# EasyEDA Pro project rc_tank.eprj

# Schematic project
Board Name: Board1; Create Date: 2025-09-07; Page Name: power1; Project Name: rc_tank; Schematic Name: project; Update Date: 2025-09-14; Company: 嘉立创EDA; Page Size: A4; Version: V1.0
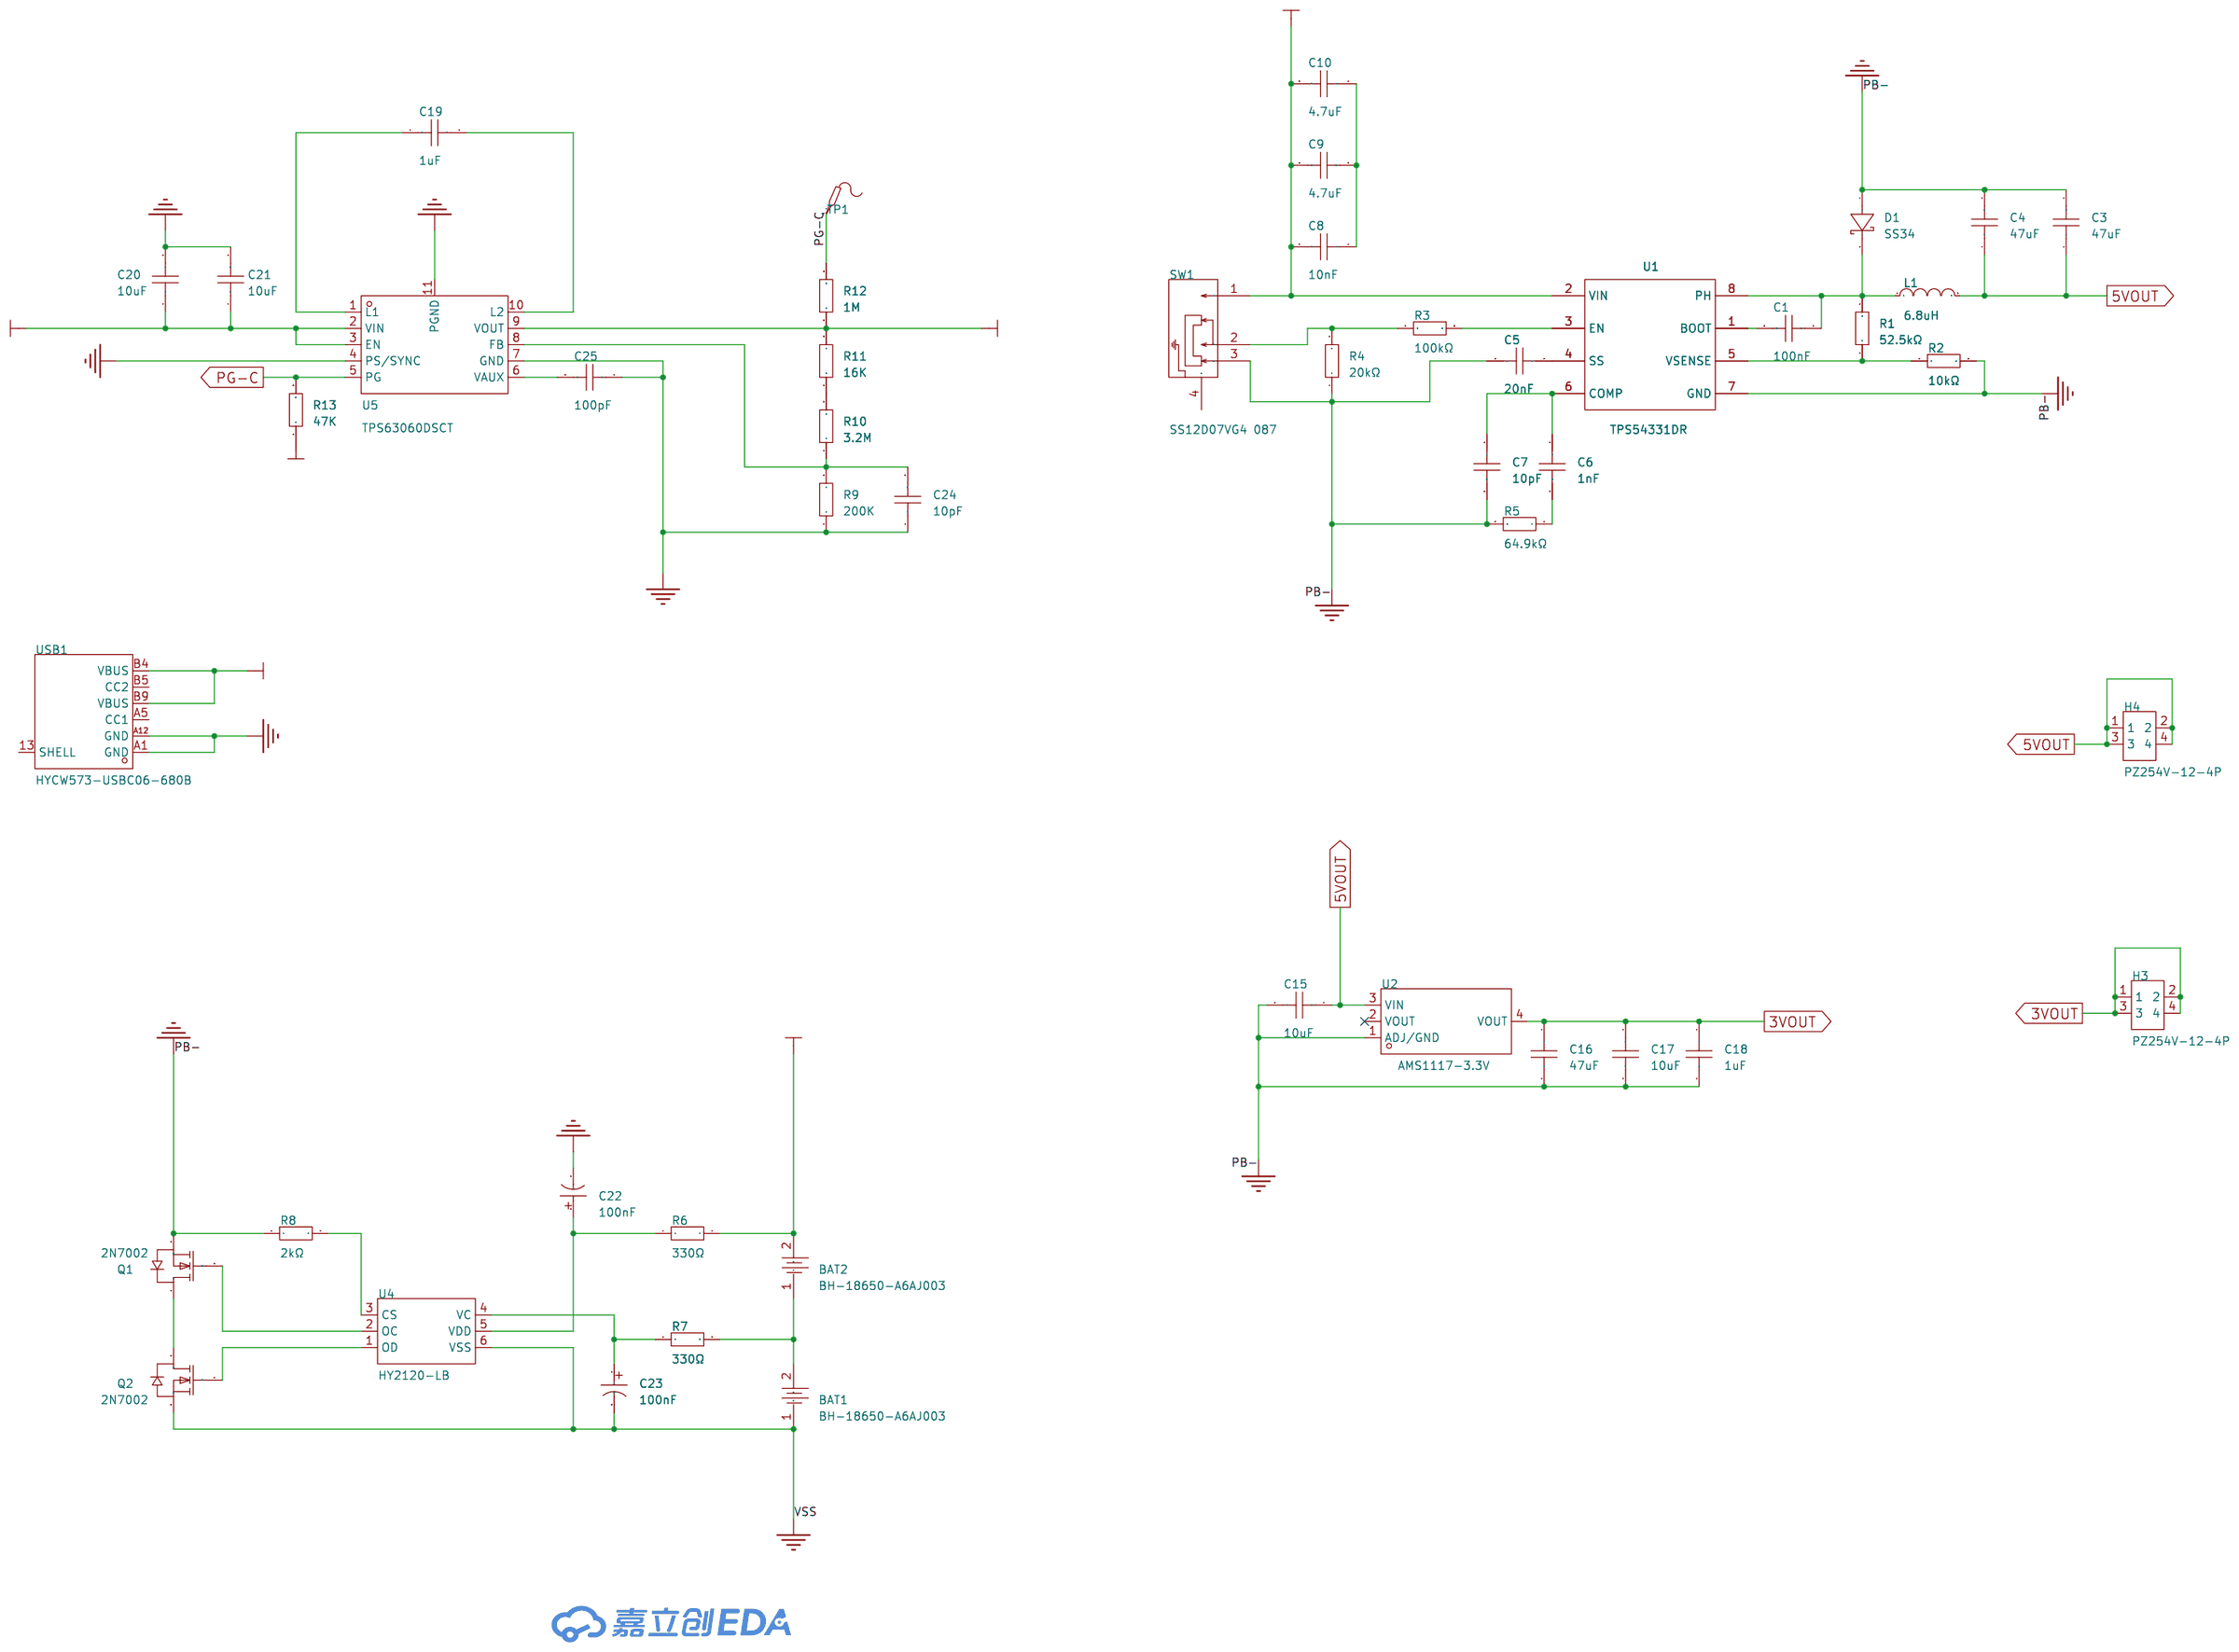
[diagram p0: schematic sheet]

## Parts
BAT1  BH-18650-A6AJ003  [BAT-TH_BH-18650-A5BJ003]
BAT2  BH-18650-A6AJ003  [BAT-TH_BH-18650-A5BJ003]
C1  100nF  [C0603]
C3  47uF  [CAP-TH_BD5.0-P2.00-D0.5-FD-A]
C4  47uF  [CAP-TH_BD5.0-P2.00-D0.5-FD-A]
C5  20nF  [C0603]
C6  1nF  [C0603]
C7  10pF  [C0603]
C8  10nF  [C0603]
C9  4.7uF  [C0805]
C10  4.7uF  [C0805]
C15  10uF  [CAP-TH_BD5.0-P2.00-D0.5-FD-A]
C16  47uF  [CAP-TH_BD6.3-P2.50-D0.6-FD]
C17  10uF  [CAP-TH_BD5.0-P2.00-D0.5-FD-A]
C18  1uF  [C0603]
C19  1uF  [C0603]
C20  10uF  [C0603]
C21  10uF  [C0603]
C22  100nF  [CAP-TH_BD5.0-P2.00-D0.8-FD]
C23  100nF  [CAP-TH_BD5.0-P2.00-D0.8-FD]
C24  10pF  [C0603]
C25  100pF  [C0603]
D1  SS34  [SMA_L4.3-W2.6-LS5.0-FD]
H3  PZ254V-12-4P  [HDR-TH_4P-P2.54-V-M-R2-C2-S2.54]
H4  PZ254V-12-4P  [HDR-TH_4P-P2.54-V-M-R2-C2-S2.54]
L1  6.8uH  [IND-SMD_L7.0-W6.6]
Q1  2N7002  [SOT-23-3_L2.9-W1.3-P1.90-LS2.4-BR]
Q2  2N7002  [SOT-23-3_L2.9-W1.3-P1.90-LS2.4-BR]
R1  52.5kΩ  [R0805]
R2  10kΩ  [R0603]
R3  100kΩ  [R0603]
R4  20kΩ  [R0603]
R5  64.9kΩ  [R0603]
R6  330Ω  [R0603]
R7  330Ω  [R0603]
R8  2kΩ  [R0603]
R9  200K  [R0603]
R10  3.2M  [R0603]
R11  16K  [R0603]
R12  1M  [R0603]
R13  47K  [R0603]
SW1  SS12D07VG4 087  [SW-TH_SS12D07VG4]
TP1  -  [Test-Point-0.5mm]
U1  TPS54331DR  [SOIC-8_L5.0-W4.0-P1.27-LS6.0-BL]
U2  AMS1117-3.3V  [SOT-223-4_L6.5-W3.5-P2.30-LS7.0-TR]
U4  HY2120-LB  [SOT-23-6_L2.9-W1.6-P0.95-LS2.8-BR]
U5  TPS63060DSCT  [WSON-10_L3.0-W3.0-P0.50-BL-EP-A]
USB1  HYCW573-USBC06-680B  [USB-C-SMD_HYCW573-USBC06-680B]

## Library data of the parts
BAT1 BAT2 = BH-18650-A6AJ003: Supplier Part: C5371778; Manufacturer: MYOUNG(美阳); JLCPCB Part Class: 扩展库; Datasheet: https://atta.szlcsc.com/upload/public/pdf/source/20231218/F59CE24993943D35EA131B0A1D7CE933.pdf; Supplier: LCSC; Contact Material: 不锈钢; Contact Plating: 镍; Operating Temperature Range: -25℃~+85℃
C1 = CGA0603X7R104K500JT: LCSC Part Name: 100nF ±10% 50V; Supplier Part: C6119867; Manufacturer: HRE(芯声); Supplier Footprint: 0603; JLCPCB Part Class: Extended Part; Datasheet: https://atta.szlcsc.com/upload/public/pdf/source/20250103/C44077DA9E7B3EFAE02F22B6D3D1CBC9.pdf; Supplier: LCSC; Tolerance: ±10%; Voltage Rating: 50V; Temperature Coefficient: X7R
C3 C4 = ERG35V47M5X11: LCSC Part Name: 47uF ±20% 35V; Supplier Part: C47344181; Manufacturer: JIERR(捷而瑞); Supplier Footprint: 插件,D5xL11mm; JLCPCB Part Class: Extended Part; Datasheet: https://item.szlcsc.com/datasheet/ERG35V47M5X11/49556622.html; Supplier: LCSC; Tolerance: ±20%; Voltage Rating: 35V; Ripple Current: 260mA@100kHz; Equivalent Series Resistance(ESR): 380mΩ@100kHz; Pin Spacing: 2mm; Diameter: 5mm; Height - Seated (Max): 11mm; Lifetime: 2000hrs@105℃; Operating Temperature: -40℃~+105℃
C5 = CC0603KRX7R9BB203: LCSC Part Name: 20nF ±10% 50V; Supplier Part: C282065; Manufacturer: YAGEO(国巨); Supplier Footprint: 0603; JLCPCB Part Class: Extended Part; Datasheet: https://atta.szlcsc.com/upload/public/pdf/source/20180910/C282072_33301C7F631E79921B82A8DAC6BCC5B3.pdf; Supplier: LCSC; Tolerance: ±10%; Voltage Rated: 50V; Temperature Coefficient: X7R
C6 = CC0603KRX7R9BB102: LCSC Part Name: 1nF ±10% 50V; Supplier Part: C100040; Manufacturer: YAGEO(国巨); Supplier Footprint: 0603; JLCPCB Part Class: Extended Part; Datasheet: https://atta.szlcsc.com/upload/public/pdf/source/20180910/C282072_33301C7F631E79921B82A8DAC6BCC5B3.pdf; Supplier: LCSC; Tolerance: ±10%; Voltage Rated: 50V; Temperature Coefficient: X7R
C7 = CL10C100JB8NNNC: LCSC Part Name: 10pF ±5% 50V; Supplier Part: C1634; Manufacturer: SAMSUNG(三星); Supplier Footprint: 0603; JLCPCB Part Class: Basic Part; Datasheet: https://item.szlcsc.com/datasheet/CL10C100JB8NNNC/1986.html; Supplier: LCSC; Tolerance: ±5%; Voltage Rating: 50V; Temperature Coefficient: C0G
C8 = 0603B103K500NT: LCSC Part Name: 10nF ±10% 50V; Supplier Part: C57112; Manufacturer: FH(风华); Supplier Footprint: 0603; JLCPCB Part Class: Basic Part; Datasheet: https://item.szlcsc.com/datasheet/0603B103K500NT/58143.html; Supplier: LCSC; Tolerance: ±10%; Voltage Rating: 50V; Temperature Coefficient: X7R
C9 C10 = CL21A475KAQNNNE: LCSC Part Name: 4.7uF ±10% 25V; Supplier Part: C1779; Manufacturer: SAMSUNG(三星); Supplier Footprint: 0805; JLCPCB Part Class: Basic Part; Datasheet: https://item.szlcsc.com/datasheet/CL21A475KAQNNNE/2131.html; Supplier: LCSC; Tolerance: ±10%; Voltage Rating: 25V; Temperature Coefficient: X5R
C15 C17 = ERG25V10M5X11: LCSC Part Name: 10uF ±20% 25V; Supplier Part: C47344176; Manufacturer: JIERR(捷而瑞); Supplier Footprint: 插件,D5xL11mm; JLCPCB Part Class: Extended Part; Datasheet: https://item.szlcsc.com/datasheet/ERG25V10M5X11/49556617.html; Supplier: LCSC; Tolerance: ±20%; Voltage Rating: 25V; Ripple Current: 100mA@100kHz; Equivalent Series Resistance(ESR): 3.3Ω@100kHz; Pin Spacing: 2mm; Diameter: 5mm; Height - Seated (Max): 11mm; Lifetime: 2000hrs@105℃; Operating Temperature: -40℃~+105℃
C16 = ERA50V47M6X11: LCSC Part Name: 47uF ±20% 50V; Supplier Part: C49256811; Manufacturer: JIERR(捷而瑞); Supplier Footprint: 插件,D6.3xL11mm; JLCPCB Part Class: Extended Part; Datasheet: https://item.szlcsc.com/datasheet/ERA50V47M6X11/51692211.html; Supplier: LCSC; Tolerance: ±20%; Voltage Rating: 50V; Ripple Current: 133mA@120Hz; Pin Spacing: 2.5mm; Diameter: 6.3mm; Height - Seated (Max): 11mm; Lifetime: 2000hrs@105℃; Operating Temperature: -40℃~+105℃
C18 = CL10A105KB8NNNC: LCSC Part Name: 1uF ±10% 50V; Supplier Part: C15849; Manufacturer: SAMSUNG(三星); Supplier Footprint: 0603; JLCPCB Part Class: Basic Part; Datasheet: https://item.szlcsc.com/datasheet/CL10A105KB8NNNC/16531.html; Supplier: LCSC; Tolerance: ±10%; Voltage Rating: 50V; Temperature Coefficient: X5R
C19-C21 C24 C25 = CAP_0603: Supplier Footprint: 0603
C22 C23 = KM104M050D11RR0VH2FP0: LCSC Part Name: 100nF ±20% 50V; Supplier Part: C28061; Manufacturer: Chengx(承兴); Supplier Footprint: 插件,D5xL11mm; JLCPCB Part Class: 扩展库; Datasheet: https://item.szlcsc.com/datasheet/KM104M050D11RR0VH2FP0/28811.html; Supplier: LCSC; Tolerance: ±20%; Voltage Rating: 50V; Pin Spacing: 2mm; Diameter: 5mm; Height - Seated (Max): 11mm; Lifetime: 1000hrs@105℃
D1 = SS34_C7420365: LCSC Part Name: 电压:40V 电流:3A; Supplier Part: C7420365; Manufacturer: R+O(宏嘉诚); Supplier Footprint: SMA(DO-214AC); JLCPCB Part Class: 扩展库; Datasheet: https://item.szlcsc.com/datasheet/SS34/8397187.html; Supplier: LCSC; Diode Configuration: 独立式; Voltage - Forward(Vf@If): 550mV@3.0A; Voltage - DC Reverse(Vr): 40V; Current - Rectified: 3A; Reverse Leakage Current (Ir): 200uA@40V
H3 H4 = PZ254V-12-4P: LCSC Part Name: 2x2P 间距:2.54mm 方针 直插; Supplier Part: C492419; Manufacturer: XFCN(兴飞); Supplier Footprint: 插件,P=2.54mm; JLCPCB Part Class: 扩展库; Datasheet: https://item.szlcsc.com/datasheet/PZ254V-12-4P/502975.html; Supplier: LCSC; Pin Structure: 2x2P; Pitch: 2.54mm; Row Spacing: 2.54mm; Circluar Pins/Square Pins: 方针; Mounting Type: 直插; Number of Rows: 双排; Number of Pins: 4P; Length of Mating Pin: 6mm; Insulation Height: 2.5mm; Length of End Connection Pin: 3mm; Contact Material: 黄铜; Operating Temperature: -40℃~+105℃; Color: 黑色
L1 = FXL0630-6R8-M: LCSC Part Name: 6.8uH ±20% 6A; Supplier Part: C167221; Manufacturer: cjiang(长江微电); Supplier Footprint: SMD,6.6x7mm; JLCPCB Part Class: Extended Part; Datasheet: https://atta.szlcsc.com/upload/public/pdf/source/20250421/DC75C633ACB13F952A25DE8912719752.pdf; Supplier: LCSC; Tolerance: ±20%; Current Rating: 5A; Current - Saturation(Isat): 6A; DC Resistance(DCR): 48mΩ; Type: 一体成型电感
Q1 Q2 = 2N7002_C7420321: LCSC Part Name: N沟道,电流:115mA,耐压:60V; Supplier Part: C7420321; Manufacturer: R+O(宏嘉诚); Supplier Footprint: SOT-23; JLCPCB Part Class: 扩展库; Datasheet: https://item.szlcsc.com/datasheet/2N7002/8397143.html; Supplier: LCSC; Number: 1个N沟道; Drain to Source Voltage: 60V; Current - Continuous Drain(Id): 115mA; RDS(on): 900mΩ@10V; Pd - Power Dissipation: 225mW; Gate Threshold Voltage (Vgs(th)): 1.6V@250uA; Gate Charge(Qg): 1.6nC@10V; Input Capacitance(Ciss): 50pF; Reverse Transfer Capacitance (Crss@Vds): 5pF; Operating Temperature: -55℃~+150℃; Type: N沟道; Output Capacitance(Coss): 25pF
R1 = PHT0805Y5252BGT: LCSC Part Name: 52.5kΩ ±0.1%; Supplier Part: C4184401; Manufacturer: VISHAY(威世); JLCPCB Part Class: Extended Part; Datasheet: https://atta.szlcsc.com/upload/public/pdf/source/20241111/797EBD90FB0B2A6A48D0A1D987241273.pdf; Supplier: LCSC; Tolerance: ±0.1%
R2 = 0603WAF1002T5E: LCSC Part Name: 厚膜电阻 10kΩ ±1% 100mW; Supplier Part: C25804; Manufacturer: UNI-ROYAL(厚声); Supplier Footprint: 0603; JLCPCB Part Class: Basic Part; Datasheet: https://item.szlcsc.com/datasheet/0603WAF1002T5E/26547.html; Supplier: LCSC; Type: 厚膜电阻; Tolerance: ±1%; Power(Watts): 100mW; Voltage-Supply(Max): 75V; Temperature Coefficient: ±100ppm/℃; Operating Temperature: -55℃~+155℃
R3 = 0603WAF1003T5E: LCSC Part Name: 100kΩ ±1% 100mW 厚膜电阻; Supplier Part: C25803; Manufacturer: UNI-ROYAL(厚声); Supplier Footprint: 0603; JLCPCB Part Class: Basic Part; Datasheet: https://item.szlcsc.com/datasheet/0603WAF1003T5E/26546.html; Supplier: LCSC; Type: 厚膜电阻; Tolerance: ±1%; Power(Watts): 100mW; Voltage-Supply(Max): 75V; Temperature Coefficient: ±100ppm/℃; Operating Temperature: -55℃~+155℃
R4 = 0603WAF2002T5E: LCSC Part Name: 20kΩ ±1% 100mW 厚膜电阻; Supplier Part: C4184; Manufacturer: UNI-ROYAL(厚声); Supplier Footprint: 0603; JLCPCB Part Class: Basic Part; Datasheet: https://item.szlcsc.com/datasheet/0603WAF2002T5E/4591.html; Supplier: LCSC; Type: 厚膜电阻; Tolerance: ±1%; Power(Watts): 100mW; Voltage-Supply(Max): 75V; Temperature Coefficient: ±100ppm/℃; Operating Temperature: -55℃~+155℃
R5 = FRC0603F6492TS: LCSC Part Name: 64.9kΩ ±1% 100mW 厚膜电阻; Supplier Part: C2960807; Manufacturer: FOJAN(富捷); Supplier Footprint: 0603; JLCPCB Part Class: Extended Part; Datasheet: https://item.szlcsc.com/datasheet/FRC0603F6492TS/3347909.html; Supplier: LCSC; Type: 厚膜电阻; Tolerance: ±1%; Power(Watts): 100mW; Voltage-Supply(Max): 75V; Temperature Coefficient: ±100ppm/℃; Operating Temperature: -55℃~+155℃
R6-R13 = Res_0603: Supplier Footprint: 0603
SW1 = SS12D07VG4 087: Supplier Part: C2939726; Manufacturer: SHOU HAN(首韩); Supplier Footprint: 插件; JLCPCB Part Class: Extended Part; Datasheet: https://atta.szlcsc.com/upload/public/pdf/source/20220106/E715996F66241B9FD900079FF66489BE.pdf; Supplier: LCSC; Circuit: 单刀双掷; Pin Style: PC引脚; Switch Length: 8.7mm; Switch Width: 4.4mm; Switch Height: 4.7mm; Mounting Style: 直插; Current Rating (DC): 500mA; Voltage Rating (DC): 50V; Mechanical Life: 5千次; Operating Temperature: -10℃~+50℃
TP1 = Test-Point
U1 = TPS54331DR: LCSC Part Name: 3A, 28V 输入非同步降压转换器; Supplier Part: C9865; Manufacturer: TI(德州仪器); Supplier Footprint: SOIC-8; JLCPCB Part Class: 扩展库; Datasheet: https://www.ti.com/cn/lit/gpn/tps54331; Supplier: LCSC; Function: 降压型; Output Type: 可调; Input Voltage: 3.5V~28V; Output Current: 3A; Switching Frequency: 570kHz; Operating Temperature: -40℃~+150℃@(TJ); Synchronous Rectification: 否; Number of Outputs: 1; Topology: 降压式; Quiescent Current (Iq): 1mA; Switch tube (built-in/external): 内置
U2 = AMS1117-3.3V: LCSC Part Name: 输入18V 输出3.3V 1A; Supplier Part: C5120765; Manufacturer: MSKSEMI(美森科); Supplier Footprint: SOT-223; JLCPCB Part Class: 扩展库; Datasheet: https://item.szlcsc.com/datasheet/AMS1117-3.3V/5706124.html; Supplier: LCSC; Output Type: 固定; Voltage - Supply: 12V; Output Voltage: 3.3V; Output Current: 1A; Voltage Dropout: 1.4V@(1A); standby current: 12mA; Features: 过流保护；过热保护; Operating Temperature: 0℃~+125℃@(Ta); Output Configuration: 正极; Number of Outputs: 1
U4 = HY2120-LB: Supplier Part: C168778; Manufacturer: HYCON(宏康); Supplier Footprint: SOT-23-6; JLCPCB Part Class: 扩展库; Datasheet: https://item.szlcsc.com/datasheet/HY2120-LB/180162.html; Supplier: LCSC; The Chip Type: 保护芯片; Voltage - Supply: 1.5V~10V; Charging Saturation Voltage: 4.25V; End-Off Voltage: 2.8V; Type of Battery: 锂离子/聚合物; Number of Cells: 2; Operating Temperature: -40℃~+85℃; 0V Battery Charge: 支持; Supply Current (Iq): 100nA
U5 = TPS63060DSCT: LCSC Part Name: 2A高输入电压降压-升压转换器; Supplier Part: C2070911; Manufacturer: TI(德州仪器); Supplier Footprint: WSON-10-EP(3x3); JLCPCB Part Class: 扩展库; Datasheet: https://www.ti.com/cn/lit/gpn/tps63060; Supplier: LCSC; Function: 升降压型; Output Type: 可调和固定; Input Voltage: 2.5V~12V; Output Current: 2A; Switching Frequency: 2.4MHz; Operating Temperature: -40℃~+85℃@(TA); Synchronous Rectification: 是; Number of Outputs: 1; Topology: 降压-升压式; Quiescent Current (Iq): 30uA; Switch tube (built-in/external): 内置
USB1 = HYCW573-USBC06-680B: LCSC Part Name: Type-C 母 立贴; Supplier Part: C42400237; Manufacturer: 华宇创; Supplier Footprint: SMD; Datasheet: https://item.szlcsc.com/datasheet/HYCW573-USBC06-680B/44352770.html; Supplier: LCSC; Connector Type: Type-C; Gender: 母; Mounting Type: 立贴; Number of Contacts: 6P; Number of Ports: 1; Current Rating-Power: 3A; Connect-Disconnect Life: 5千次; Length: 6.8mm; Detection color: 黑色; Operating Temperature: -25℃~+85℃

## Nets
3VOUT: C16.1 C17.1 C18.1 H3.1 H3.2 H3.3 H3.4 U2.4(VOUT)
5VOUT: C3.1 C4.1 C15.1 H4.1 H4.2 H4.3 H4.4 L1.2 U2.3(VIN)
VCC-OUT: BAT2.2 C8.2 C9.2 C10.2 R6.2 R11.2 R12.1 SW1.1 U1.2(VIN) U5.9(VOUT)
VIN: C20.1 C21.1 R13.1 U5.2(VIN) U5.3(EN) USB1.B4(VBUS) USB1.B9(VBUS)
VSS: BAT1.1 C20.2 C21.2 C22.2 C23.2 C24.1 C25.1 Q2.2(S) R9.1 U4.6(VSS) U5.4(PS/SYNC) U5.7(GND) U5.11(PGND) USB1.A1(GND) USB1.A12(GND)
PB-: C3.2 C4.2 C5.2 C7.2 C15.2 C16.2 C17.2 C18.2 D1.1(A) Q1.2(S) R2.2 R4.1 R5.2 R8.1 SW1.3 U1.7(GND) U2.1(ADJ/GND)
PG-C: R12.2 R13.2 TP1.1 U5.5(PG)
$1N828: C1.2 U1.1(BOOT)
$1N1404: R1.1 R2.1 U1.5(VSENSE)
$1N1436: R3.2 U1.3(EN)
$1N1441: R3.1 R4.2 SW1.2
$1N1501: C5.1 U1.4(SS)
$1N1628: C6.2 R5.1
$1N1677: C6.1 C7.1 U1.6(COMP)
$1N1713: C1.1 D1.2(K) L1.1 R1.2 U1.8(PH)
$1N7780: C8.1 C9.1 C10.1
$1N9160: C19.2 U5.10(L2)
$1N9166: C19.1 U5.1(L1)
$1N9574: C22.1 R6.1 U4.5(VDD)
$1N9627: C23.1 R7.1 U4.4(VC)
$1N9632: BAT1.2 BAT2.1 R7.2
$1N10063: Q1.3(D) Q2.3(D)
$1N10067: Q1.1(G) U4.2(OC)
$1N10072: Q2.1(G) U4.1(OD)
$1N10126: R8.2 U4.3(CS)
$1N10297: R10.2 R11.1
$1N10312: C24.2 R9.2 R10.1 U5.8(FB)
$1N10659: C25.2 U5.6(VAUX)

Not connected (* = marked no-connect by the designer): SW1 4; U2 2(VOUT)*; USB1 13(SHELL) A5(CC1) B5(CC2)

# Board PCB1
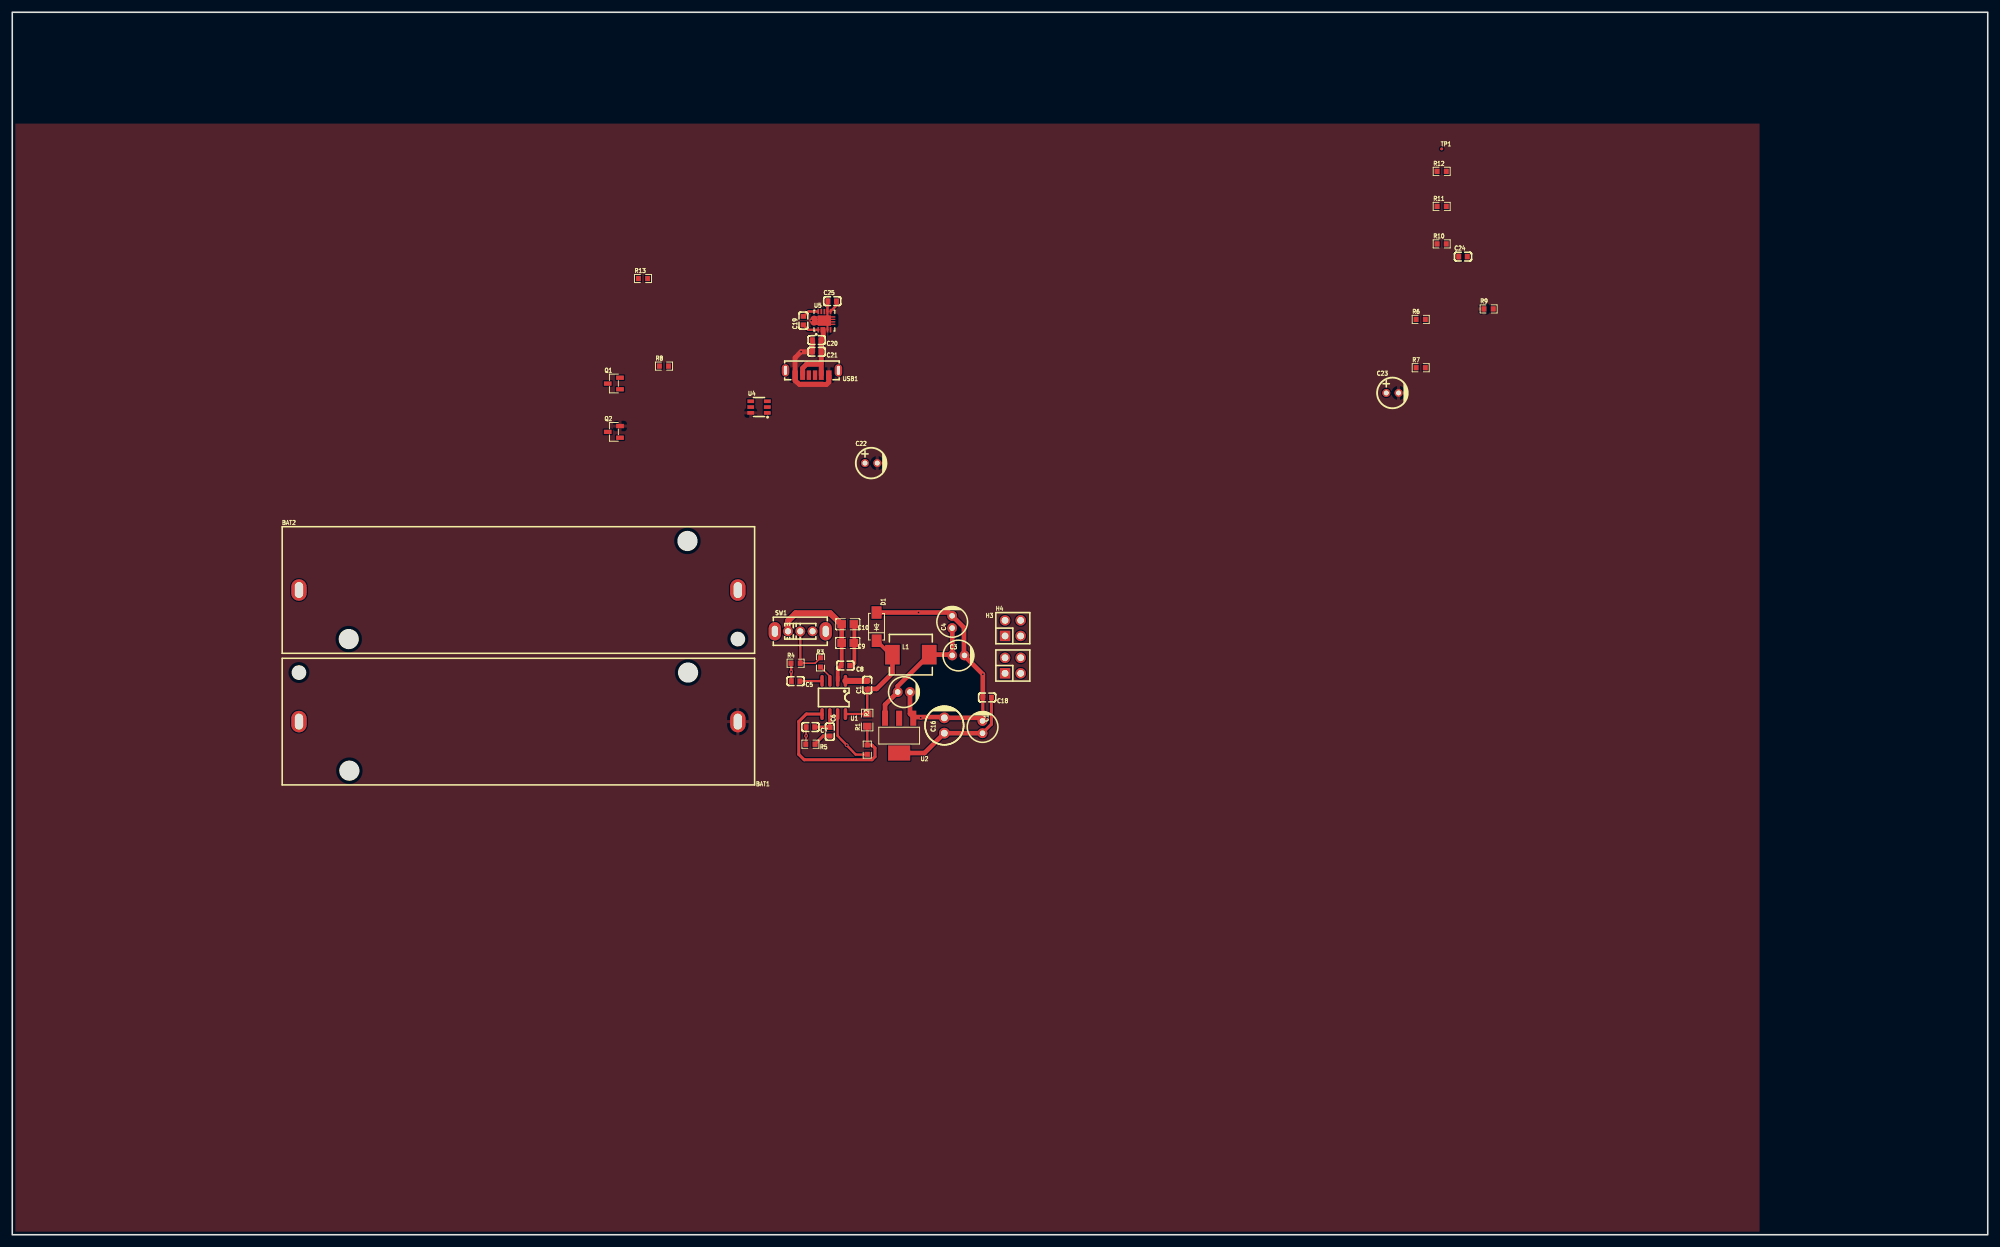
[diagram p1: board, top side]
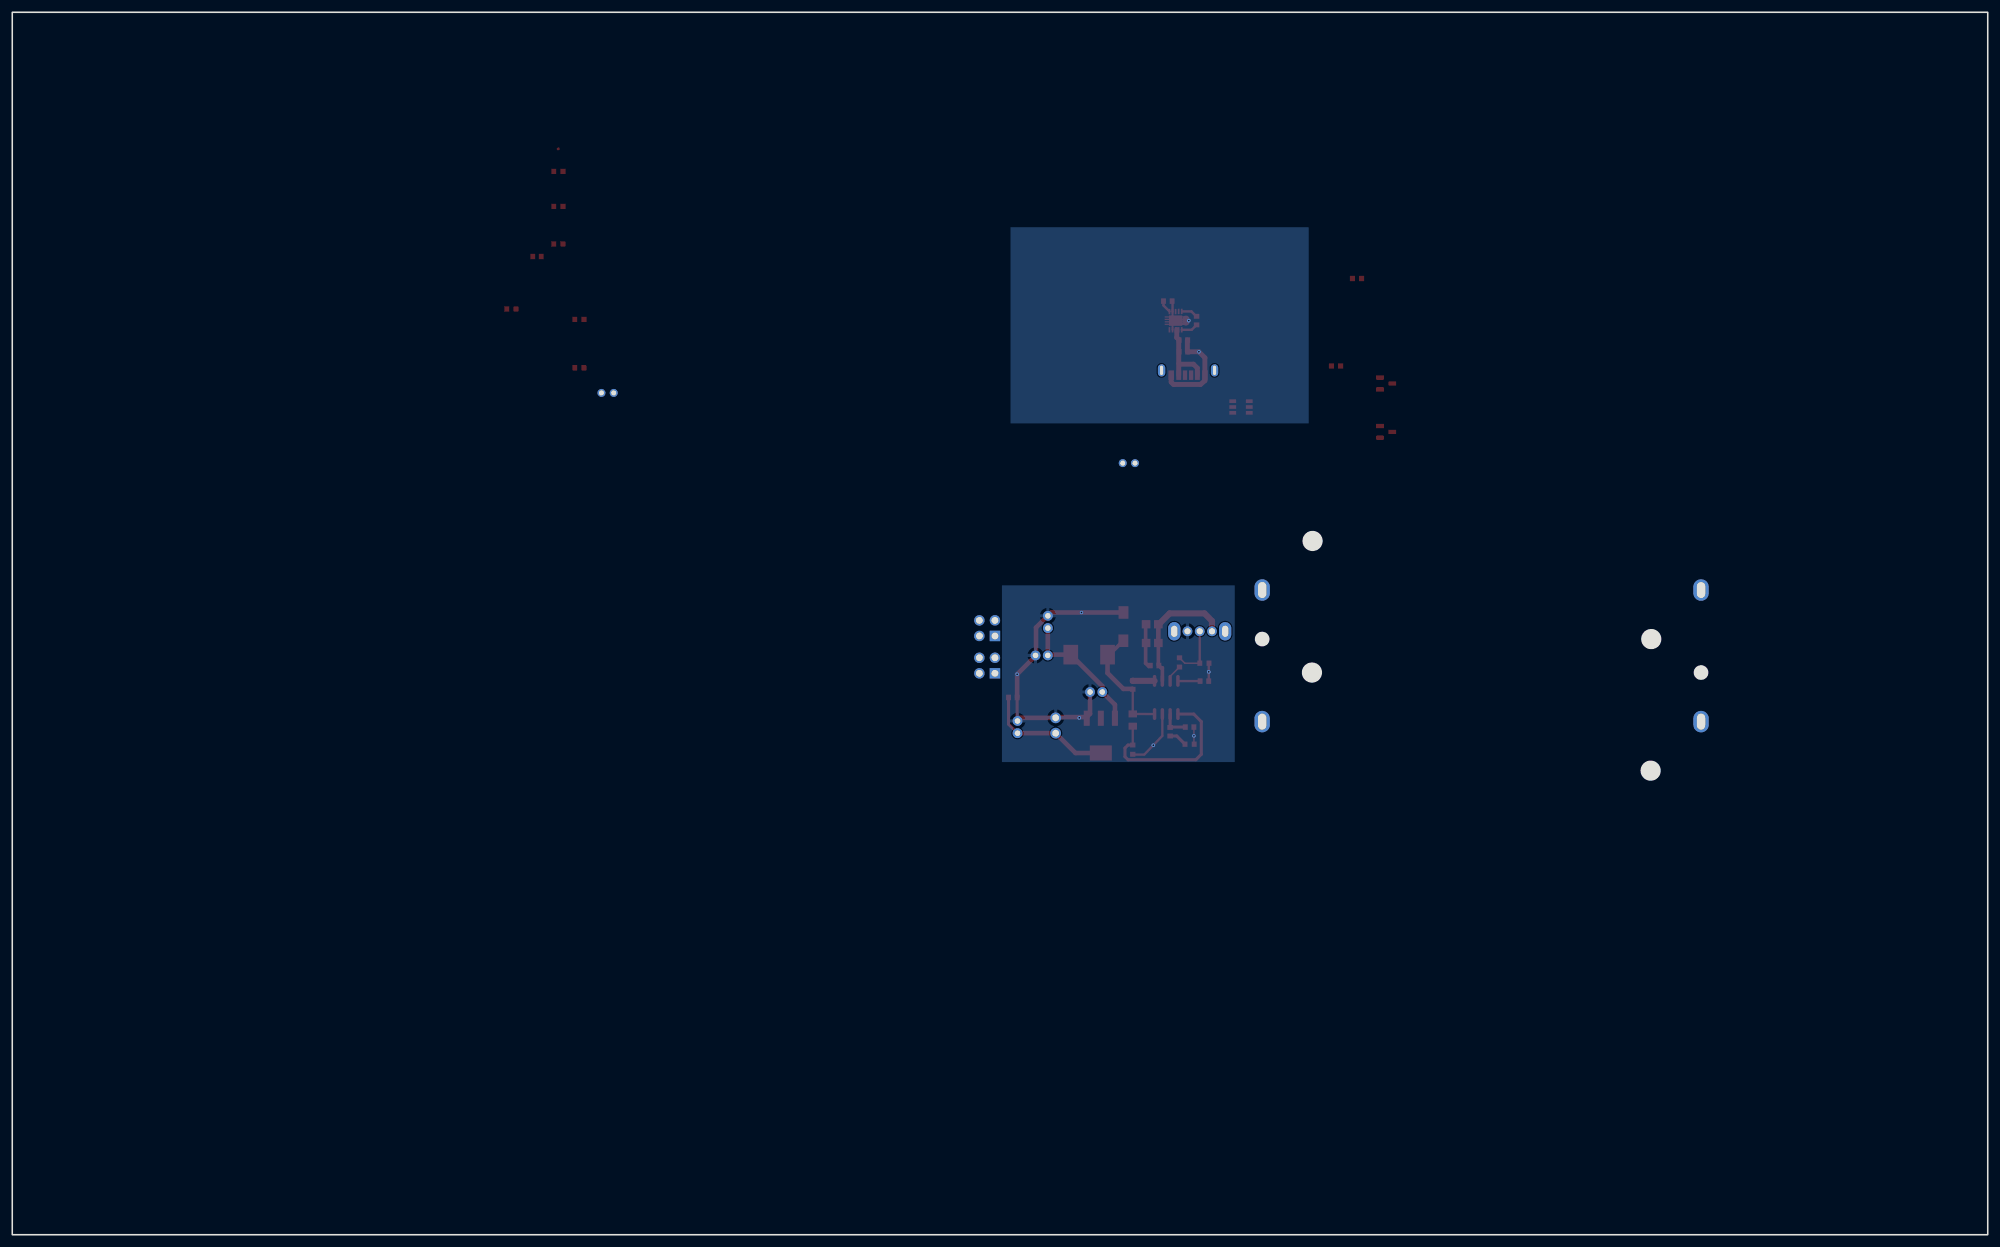
[diagram p2: board, bottom side, seen from below]

Outline 322.2 x 199.39 mm; copper layers: Top Layer, Bottom Layer. Coordinates in mm from the lower left corner of the outline.
Outline path: rectangle 322.2,0 0,199.39
Stack: Top Layer 0.035mm / Dielectric1 1.51mm FR4 er 4.5 / Bottom Layer 0.035mm

## Design rules (mm)
template: JLCPCB Capability(Two Layers Board)
spacing copperThickness1oz (default): track to track 0.102, other pairs 0.152 to 0.3
spacing copperThickness2oz: track to track 0.203, other pairs 0.152 to 0.3
track width copperThickness1oz (default): min 0.127, default 0.254, max 2.54
track width copperThickness2oz: min 0.203, default 0.254, max 2.54
differential pair differentialPair (default): width min 0.127, default 0.254, max 2.54; gap min 0.152, default 0.152
via viaSize (default): diameter min 0.5, default 0.61, max 10; hole min 0.3, default 0.305, max 6.3

## Placement (name value [footprint] x y rotation side)
BAT1  BH-18650-A6AJ003  [BAT-TH_BH-18650-A5BJ003]  82.55 83.69 180 top
BAT2  BH-18650-A6AJ003  [BAT-TH_BH-18650-A5BJ003]  82.55 105.16 0 top
C1  100nF  [C0603]  139.45 89.66 90 top
C3  47uF  [CAP-TH_BD5.0-P2.00-D0.5-FD-A]  154.31 94.49 0 top
C4  47uF  [CAP-TH_BD5.0-P2.00-D0.5-FD-A]  153.29 99.95 90 top
C5  20nF  [C0603]  127.76 90.3 180 top
C6  1nF  [C0603]  133.35 82.04 270 top
C7  10pF  [C0603]  130.18 82.8 180 top
C8  10nF  [C0603]  135.89 92.84 180 top
C9  4.7uF  [C0805]  136.27 96.52 180 top
C10  4.7uF  [C0805]  136.27 99.57 180 top
C15  10uF  [CAP-TH_BD5.0-P2.00-D0.5-FD-A]  145.42 88.52 0 top
C16  47uF  [CAP-TH_BD6.3-P2.50-D0.6-FD]  152.02 83.06 90 top
C17  10uF  [CAP-TH_BD5.0-P2.00-D0.5-FD-A]  158.24 82.8 90 top
C18  1uF  [C0603]  159 87.63 180 top
C19  1uF  [C0603]  129.03 149.1 90 top
C20  10uF  [C0603]  131.19 145.92 180 top
C21  10uF  [C0603]  131.19 144.02 180 top
C22  100nF  [CAP-TH_BD5.0-P2.00-D0.8-FD]  140.08 125.86 0 top
C23  100nF  [CAP-TH_BD5.0-P2.00-D0.8-FD]  225.1 137.3 0 top
C24  10pF  [C0603]  236.62 159.54 0 top
C25  100pF  [C0603]  133.73 152.27 0 top
D1  SS34  [SMA_L4.3-W2.6-LS5.0-FD]  140.97 99.19 270 top
H3  PZ254V-12-4P  [HDR-TH_4P-P2.54-V-M-R2-C2-S2.54]  163.19 92.84 0 top
H4  PZ254V-12-4P  [HDR-TH_4P-P2.54-V-M-R2-C2-S2.54]  163.19 98.93 0 top
L1  6.8uH  [IND-SMD_L7.0-W6.6]  146.56 94.62 0 top
Q1  2N7002  [SOT-23-3_L2.9-W1.3-P1.90-LS2.4-BR]  98.12 138.84 0 top
Q2  2N7002  [SOT-23-3_L2.9-W1.3-P1.90-LS2.4-BR]  98.12 130.95 0 top
R1  52.5kΩ  [R0805]  139.45 83.95 90 top
R2  10kΩ  [R0603]  139.45 79.12 270 top
R3  100kΩ  [R0603]  131.83 93.35 270 top
R4  20kΩ  [R0603]  127.76 93.22 0 top
R5  64.9kΩ  [R0603]  130.18 80.01 180 top
R6  330Ω  [R0603]  229.71 149.3 0 top
R7  330Ω  [R0603]  229.71 141.41 0 top
R8  2kΩ  [R0603]  106.29 141.68 0 top
R9  200K  [R0603]  240.79 151 0 top
R10  3.2M  [R0603]  233.14 161.61 0 top
R11  16K  [R0603]  233.14 167.73 0 top
R12  1M  [R0603]  233.14 173.45 0 top
R13  47K  [R0603]  102.87 155.96 0 top
SW1  SS12D07VG4 087  [SW-TH_SS12D07VG4]  128.52 98.43 0 top
TP1  -  [Test-Point-0.5mm]  233.14 177.11 0 top
U1  TPS54331DR  [SOIC-8_L5.0-W4.0-P1.27-LS6.0-BL]  133.99 87.63 180 top
U2  AMS1117-3.3V  [SOT-223-4_L6.5-W3.5-P2.30-LS7.0-TR]  144.65 81.41 180 top
U4  HY2120-LB  [SOT-23-6_L2.9-W1.6-P0.95-LS2.8-BR]  121.79 135 0 top
U5  TPS63060DSCT  [WSON-10_L3.0-W3.0-P0.50-BL-EP-A]  132.46 149.1 0 top
USB1  HYCW573-USBC06-680B  [USB-C-SMD_HYCW573-USBC06-680B]  130.43 140.59 180 top

## Footprints (pads in the part's own frame, mm; a bottom-side part is the same pattern mirrored in y, then rotated)
BAT-TH_BH-18650-A5BJ003
  oval 2.5x3.5 hole 1.34x2.58: 1(-35.79,0) 2(35.79,0)
C0603
  rect 0.8x0.9 smd: 1(-0.7,0) 2(0.7,0)
C0805
  rect 1.41x1.35 smd: 1(-1,0) 2(1,0)
CAP-TH_BD5.0-P2.00-D0.5-FD-A
  round 1.6 hole 0.9: 1(-1,0) 2(1,0)
CAP-TH_BD5.0-P2.00-D0.8-FD
  round 1.3 hole 0.8: 1(-1,0) 2(1,0)
CAP-TH_BD6.3-P2.50-D0.6-FD
  round 1.75 hole 1.1: 1(-1.25,0) 2(1.25,0)
HDR-TH_4P-P2.54-V-M-R2-C2-S2.54
  rect 1.7x1.7 hole 1.1: 1(-1.27,-1.27)
  round 1.7 hole 1.1: 2(-1.27,1.27) 3(1.27,-1.27) 4(1.27,1.27)
IND-SMD_L7.0-W6.6
  rect 2.4x3.2 smd: 1(-3,0) 2(3,0)
R0603
  rect 0.806x0.864 smd: 1(-0.753,0) 2(0.753,0)
R0805
  rect 1.133x1.377 smd: 1(-1,0) 2(1,0)
SMA_L4.3-W2.6-LS5.0-FD
  rect 2.046x1.62 smd: 1(-2.304,-0.009) 2(2.304,0.009)
SOIC-8_L5.0-W4.0-P1.27-LS6.0-BL
  oval 0.569x1.95 smd: 1(-1.905,-2.705) 2(-0.635,-2.705) 3(0.635,-2.705) 4(1.905,-2.705) 5(1.905,2.705) 6(0.635,2.705) 7(-0.635,2.705) 8(-1.905,2.705)
SOT-23-3_L2.9-W1.3-P1.90-LS2.4-BR
  rect 1.25x0.7 smd: 1(1,-0.95) 2(1,0.95) 3(-1,0)
SOT-23-6_L2.9-W1.6-P0.95-LS2.8-BR
  rect 1.1x0.6 smd: 1(1.35,-0.95) 2(1.35,0) 3(1.35,0.95) 4(-1.35,0.95) 5(-1.35,0) 6(-1.35,-0.95)
SOT-223-4_L6.5-W3.5-P2.30-LS7.0-TR
  rect 0.98x2.47 smd: 1(-2.3,-2.835) 2(0,-2.835) 3(2.3,-2.835)
  rect 3.6x2.47 smd: 4(0,2.835)
SW-TH_SS12D07VG4
  oval 1.6x1.6 hole 1: 1(-2,0) 2(0,0) 3(2,0)
  oval 2x3 hole 1x1.8: 4(4.15,0) 5(-4.15,0)
Test-Point-0.5mm
  round 0.5 smd: 1(0,0)
USB-C-SMD_HYCW573-USBC06-680B
  oval 1.2x2 hole 0.5x1.5: 13(-4.32,-0.388) 13(4.32,-0.388)
  rect 0.9x1.55 smd: A1(2.75,0.388) A12(-2.75,0.388)
  rect 0.7x1.55 smd: A5(0.5,0.388) B5(-0.5,0.388)
  rect 0.8x1.55 smd: B4(-1.52,0.388) B9(1.52,0.388)
WSON-10_L3.0-W3.0-P0.50-BL-EP-A
  rect 0.28x0.876 smd: 1(-1,-1.5) 2(-0.5,-1.5) 3(0,-1.5) 4(0.5,-1.5) 5(1,-1.5) 6(1,1.474) 7(0.499,1.472) 8(-0.001,1.473) 9(-0.5,1.5) 10(-1,1.5)
  custom 3.55x1.7 smd: 11(0,0)

## Nets
As in the schematic.

Pads without a net: SW1 4 5; U2 2; USB1 13 A5 B5

## Via types
v1: diameter 0.61, hole 0.305, Top Layer to Bottom Layer, 8 vias

## Routing (per net, layer and track width the routed paths; a pad name or vN(x,y) marks a point on that pad's centre or on a via; arc(x,y) is an arc through that point)
VSS: length 21.9
  Top Layer w0.3: U5.7 132.96,149.87 132.97,149.86 ; 130.83,148.54 132.96,148.54 132.96,147.6 132.97,147.6
  Top Layer w0.4: C25.1 132.96,152.2 132.96,150.57
  Top Layer w0.8: 130.54,145.92 130.54,144.07 C21.2 v1(128.65,144.02) 127.68,143.03 127.68,139.3 128.4,138.68 132.8,138.68 133.18,139.07 USB1.A12
  Top Layer w1.2: 130.77,148.88 130.77,149.31
  vias: v1(130.3,149.1)
PB-: length 62.9
  Top Layer w0.254: C7.2 v1(129.47,81.36) 129.47,80.06 R5.2
  Top Layer w0.381: 127.05,93.21 127.05,90.41 126.94,90.3 ; U1.7 134.62,81.37 137.56,78.32 139.45,78.32
  Top Layer w0.5: 158.3,87.63 158.3,83.87 C17.2
  Top Layer w0.75: D1.1 152.76,101.49 155.22,99.03 155.22,94.5 v1(158.3,91.42) 158.3,87.63 ; 146.42,88.41 146.42,84.97 146.95,84.43 152.04,84.43 152.15,84.33 ; C16.2 158.24,84.31
  vias: v1(127.05,91.81) v1(136.09,79.85) v1(147.81,101.49) v1(148.17,84.31)
$1N1436: length 2.9
  Top Layer w0.254: U1.3 133.35,91.07 R3.2
$1N1441: length 8.9
  Top Layer w0.254: R4.2 130.95,93.22 R3.1
  Top Layer w0.381: SW1.2 128.52,93.22
$1N1713: length 19.9
  Top Layer w0.381: U1.8 R1.2 C1.1
  Top Layer w0.6: 143.81,93.98 143.81,94.05 D1.2
  Top Layer w0.75: C1.1 139.51,89.03 140.97,89.03 143.56,91.62 L1.1
$1N7780: length 9.7
  Top Layer w0.5: 135.27,92.92 135.19,92.84
  Top Layer w0.6: 134.62,90.34 134.62,92.46 134.81,92.46 135.19,92.84 ; 135.27,96.52 135.27,92.92
  Top Layer w0.75: 135.27,99.57 135.27,96.6 135.19,96.52
3VOUT: length 21.4
  Top Layer w0.5: 158.24,81.81 159.7,83.27 C18.1
  Top Layer w0.75: U2.4 148.78,78.57 C16.1 158.13,81.81 158.24,81.92
5VOUT: length 21.6
  Top Layer w0.75: U2.3 142.35,86.46 C15.1 144.41,89.47 L1.2 153.18,94.62 C3.1 153.31,98.93 C4.1
VCC-OUT: length 18.7
  Top Layer w0.6: 136.84,92.71 137.35,93.21 137.35,99.5 137.41,99.57
  Top Layer w1: SW1.1 126.52,100.11 127.76,101.35 133.42,101.35 135.2,99.57
VIN: length 12.1
  Top Layer w0.8: USB1.B9 128.91,141.36 129.54,141.99 131.83,141.99 131.95,142.11 ; USB1.B4 131.95,146 132.27,146.32 132.27,147.65
$1N828: length 3.6
  Top Layer w1: U1.1 139.42,90.34 C1.2
$1N1404: length 28.5
  Top Layer w0.381: 139.45,79.92 139.45,82.82
  Top Layer w0.5: U1.5 129.5,84.93 128.27,83.69 128.27,78.36 129.16,77.47 140.21,77.47 140.72,77.98 140.72,79.38 140.22,79.87 R2.1
$1N1501: length 3.8
  Top Layer w0.381: 128.33,90.3 132.04,90.3 U1.4
$1N1628: length 3
  Top Layer w0.5: R5.1 132.26,81.34 C6.2
$1N1677: length 4.6
  Top Layer w0.5: C7.1 133.29,82.8 C6.1 ; U1.6 133.35,82.84
$1N9160: length 2.7
  Top Layer w0.4: 129.03,149.75 129.88,150.6 131.37,150.6
$1N9166: length 2.8
  Top Layer w0.4: C19.1 129.83,147.6 U5.1
$1N10659: length 2.1
  Top Layer w0.4: 133.46,150.6 134.43,151.57 C25.2

## Copper pours and planes (outline as drawn; the poured copper is in the pictures)
VSS on Top Layer: -38.1,181.23 284.99,181.23 284.99,-2.16 -38.1,-2.16
VSS on Bottom Layer: 110.74,164.34 159.38,164.34 159.38,132.33 110.74,132.33
PB- on Bottom Layer: 122.81,105.92 160.78,105.92 160.78,77.09 122.81,77.09
